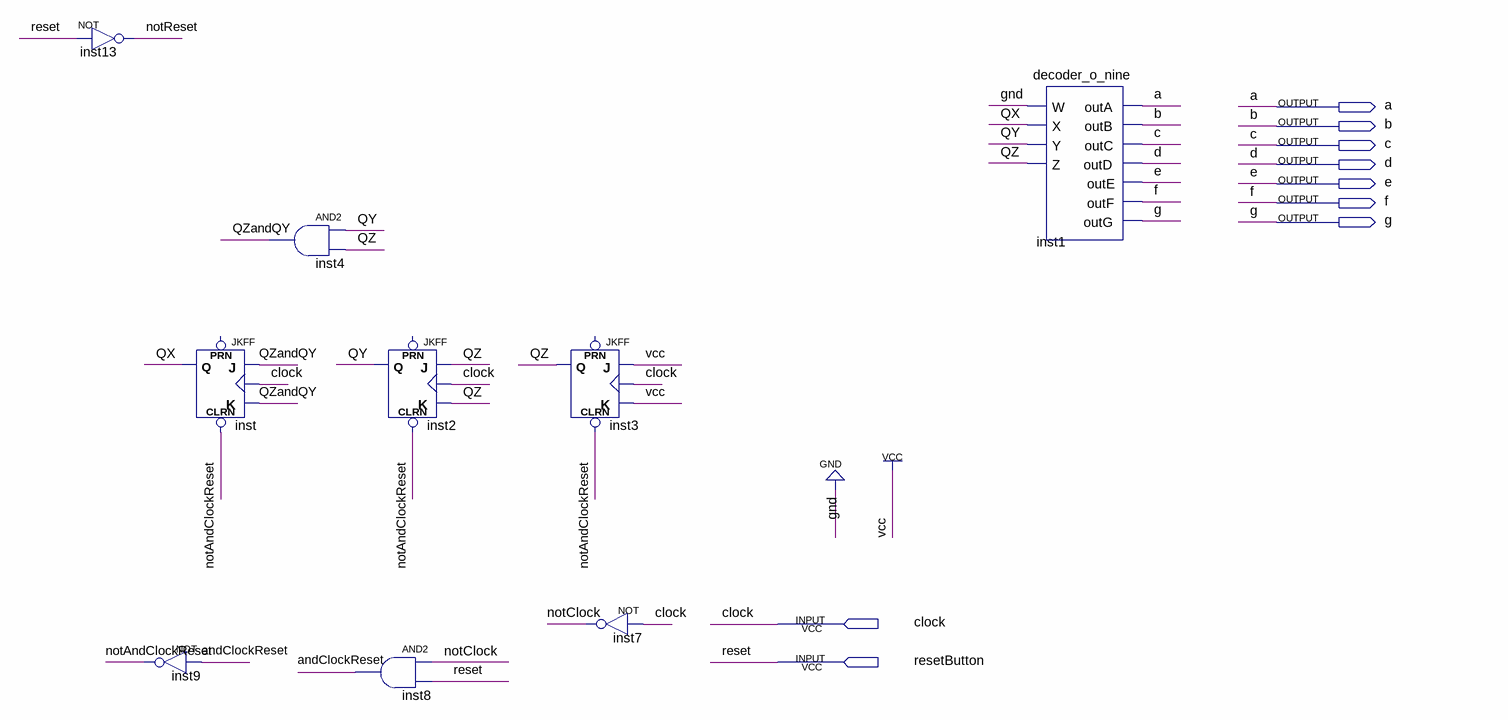
[diagram p0: schematic sheet]
// Quartus schematic threeBitsCounterSync.bdf as structural Verilog: 9 symbols, 9 pins
module threeBitsCounterSync (
  input  clock,
  input  resetButton,
  output a,
  output b,
  output c,
  output d,
  output e,
  output f,
  output g
);

  wire andClockReset, notAndClockReset, notClock, notReset, QX, QY, QZ, QZandQY;

  not inst13 (notReset, resetButton);
  JKFF inst (.CLRN(notAndClockReset), .K(QZandQY), .J(QZandQY), .CLK(clock), .Q(QX));  // open: PRN
  not inst9 (notAndClockReset, andClockReset);
  and inst4 (QZandQY, QY, QZ);
  and inst8 (andClockReset, notClock, resetButton);
  JKFF inst2 (.CLRN(notAndClockReset), .K(QZ), .J(QZ), .CLK(clock), .Q(QY));  // open: PRN
  JKFF inst3 (.CLRN(notAndClockReset), .K(1'b1), .J(1'b1), .CLK(clock), .Q(QZ));  // open: PRN
  not inst7 (notClock, clock);
  decoder_o_nine inst1 (
    .W(1'b0), .X(QX), .Y(QY), .Z(QZ), .outA(a), .outB(b), .outC(c), .outD(d), .outE(e), .outF(f), .outG(g));

  // Other names for the same wires on the sheet: reset = resetButton
endmodule
